# EAGLE design BuildUpons-OffsetLED (EAGLE 7.7.0)
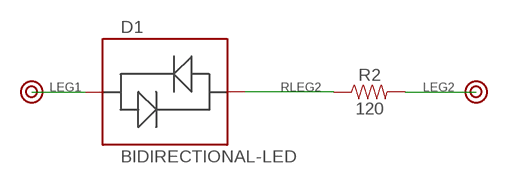
[diagram p0: schematic, sheet 1]

## Parts
D1  BIDIRECTIONAL-LED  [BIDIRECTIONAL-LED]
J1  METAL-LEGMOREPASTE  [METAL-LEG]
J2  METAL-LEGMOREPASTE  [METAL-LEG]
R2  120  RESISTOR1  [0402]

## Nets
LEG1: D1.LED1 J1.1(PIN1)
LEG2: J2.1(PIN1) R2.2
RLEG2: D1.LED2 R2.1

## Library data of the parts
D1 = BuildUpons:BIDIRECTIONAL-LED
J1 J2 = BuildUpons:METAL-LEG
R2 = BuildUpons:RESISTOR

## Board
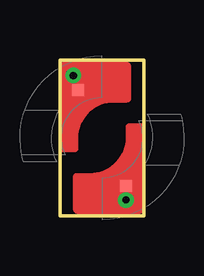
[diagram p1: board, top side]
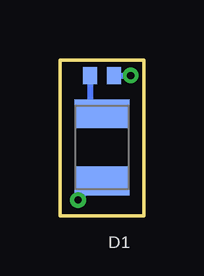
[diagram p2: board, bottom side, seen from below]

Size 3.5 x 6.5 mm. Coordinates in mm from the lower left corner, seen from the top.
Outline: 3.5,0 0,0 0,6.5 3.5,6.5 3.5,0
Copper layers (1*16): Top 0.035mm / dielectric 1.5mm / Bottom 0.035mm
Design rules "SparkFun-2-layer-TIGHT": minimum track width 7mil, minimum drill 15mil, track to track 7mil, track to pad 7mil, pad to pad 7mil, via to via 7mil, smd to smd 7mil, copper to edge 7mil, drill to drill 7mil, minimum pad ring 7mil, minimum via ring 7mil, stop-mask expansion 4mil, vias tented up to drill 25mil, thermal gap 10mil

### Footprints (pad centres in the part's own frame; a part is rotated, then mirrored left to right if it is on the bottom)
BIDIRECTIONAL-LED = smd 2.3 x 1.2: LED1 0,1.4; LED2 0,-1.4
METAL-LEG = smd 0.5 x 0.5: 1 -1,2
0402 = smd 0.6 x 0.7: 1 -0.5,0; 2 0.5,0

### Placement (x,y rotation side)
D1  1.75,2.85 180 bottom
J1  1.75,3.25 180 top
J2  1.75,3.25 0 top
R2  1.75,5.85 0 bottom

### Tracks (layer width: path | path; a pad name or v marks a point on that pad's centre or on a via)
LEG1  (via drill 0.3)
  Top 0.254: J1.1 v2.75,0.65
  Bottom 0.254: D1.LED1 1.75,1.65 v2.75,0.65
LEG2  (via drill 0.3)
  Top 0.254: J2.1 0.75,5.65 v0.55,5.85
  Bottom 0.254: R2.2 v0.55,5.85
RLEG2
  Bottom 0.254: R2.1 2.25,4.75 D1.LED2